# Altium schematic sheet MCU Power.SchDoc
size A; SheetNumber: 3; SheetTotal: 8
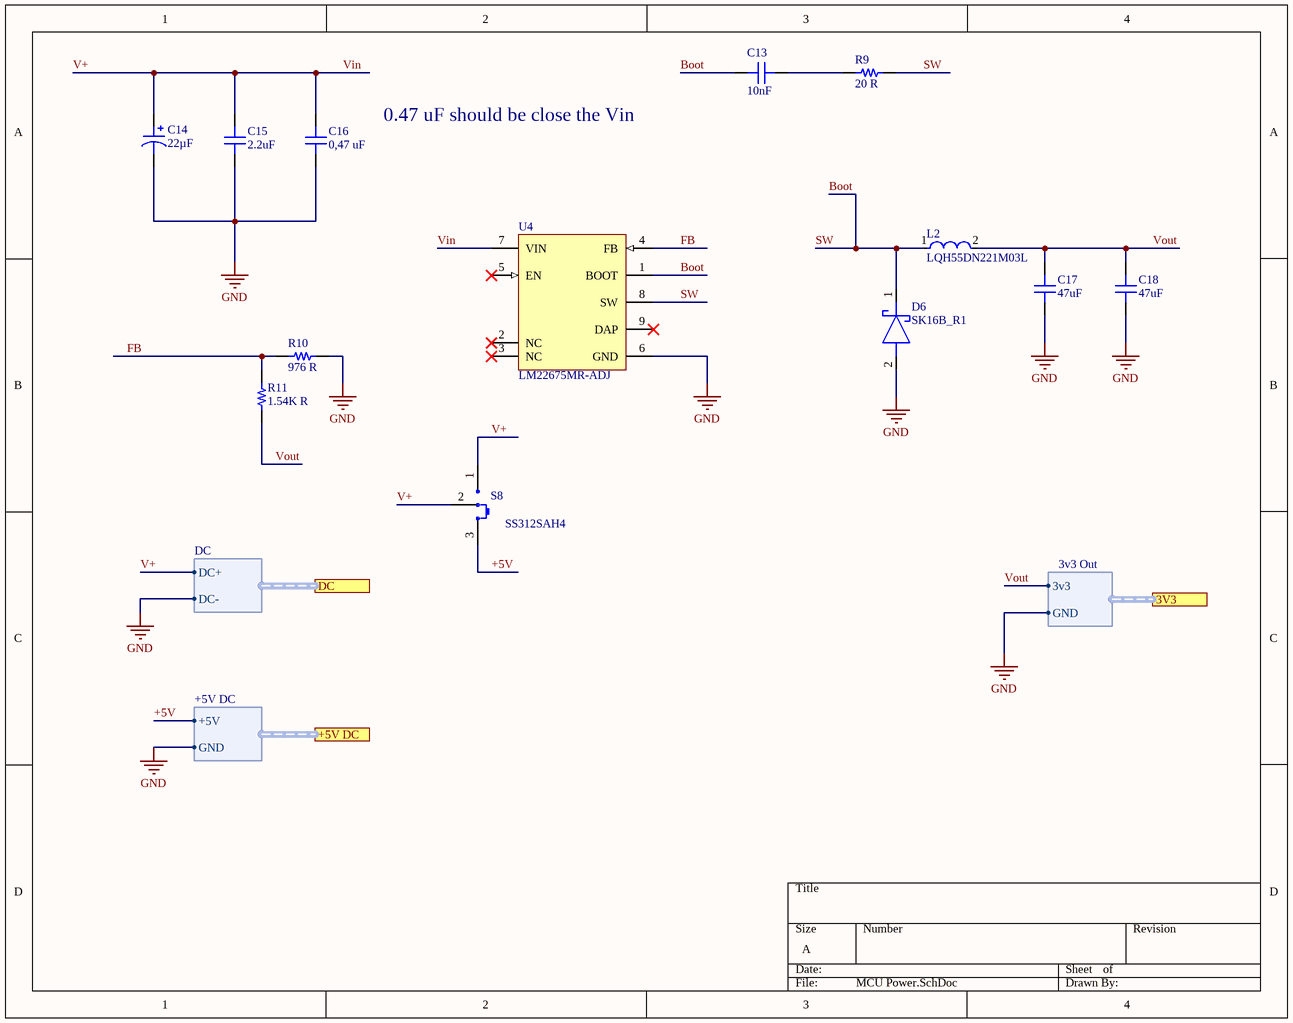
[diagram p0: MCU Power.SchDoc]

## Parts
C13  10nF  [CAP 0603_1608]
C14  22µF  [CAP TH ALUM ELEC D12.50mm S5.00mm H27.00mm]
C15  2.2uF  [CAP 0805_2012]
C16  0,47 uF  [CAP 0603_1608]
C17  47uF  [CAP 0805_2012]
C18  47uF  [CAP 0805_2012]
D6  SK16B_R1  [DIONM5236X261N]
L2  LQH55DN221M03L  [FP-LQH55DN_03-MFG(100uH)]
R9  20 R  [RES 0603_1608]
R10  976 R  [RES 0603_1608]
R11  1.54K R  [RES 0603_1608]
S8  SS312SAH4  [NKK SS312SAH4]
U4  LM22675MR-ADJ  [MRA08B_M]

## Ports
3V3 (harness 3v3 Out), +5V DC (harness +5V DC), DC (harness DC)

## Harnesses
3v3 Out: 3v3, GND
DC: DC+, DC-
+5V DC: +5V, GND

## Nets
GND: C14.2 C15.1 C16.1 C17.1 C18.1 D6.2(A) R10.1 U4.6(GND) ; port 3V3.GND, port DC.DC-, port +5V DC.GND
+5V: S8.3 ; port +5V DC.+5V
Boot: C13.2 D6.1(K) L2.1 R9.1 U4.1(BOOT) U4.8(SW)  [also labelled SW]
FB: R10.2 R11.2 U4.4(FB)
V+: C14.1 C15.2 C16.2 S8.1 S8.2(COM) U4.7(VIN) ; port DC.DC+  [also labelled Vin]
Vout: C17.2 C18.2 L2.2 R11.1 ; port 3V3.3v3
NetC13_1: C13.1 R9.2

Not connected (* = marked no-connect by the designer): U4 2(NC)* 3(NC)* 5(EN)* 9(DAP)*

## Notes on the sheet
- 0.47 uF should be close the Vin

## Library data of the parts
C13 C16 = C0603X101F5GACAUTO: CAP CER 100PF 50V C0G/NP0 0603; Manufacturer: KEMET; Temperature Coefficient: C0G, NP0; Tolerance: ±1%; Part Number: C0603X101F5GACAUTO; Applications: Automotive, Boardflex Sensitive; Capacitance: 100pF; ComponentLink1Description: Datasheet; ComponentLink1URL: https://api.kemet.com/component-edge/download/datasheet/C0603X101F5GACAUTO.pdf; ComponentLink2Description: DigiKey Link; ComponentLink2URL: http://digikey.com/product-detail/en/kemet/C0603X101F5GACAUTO/399-20434-1-ND/9925038; Device Package: 0603 (1608 Metric); Features: Low ESL, Soft Termination; LastUpdated: 2.09.2020 01:03:36; Lifecycle Status: Active; Minimum Order: 1; Mounting Type: Surface Mount, MLCC; Operating Temperature: -55°C ~ 125°C; Package / Case: 0603 (1608 Metric); Packaging: TapeAndReel; PartId: 2136; Part Status: Active; Price: 0.44; Ratings: AEC-Q200; Series: SMD Auto C0G Flex; Size / Dimension: 0.063" L x 0.031" W (1.60mm x 0.80mm); Supplier 1: DigiKey; Supplier Part Number 1: 399-20434-1-ND; Thickness (Max): 0.037" (0.95mm); Voltage - Rated: 50V
  C13: Value: 10nF
  C16: Value: 0,47 uF
C14 = UVZ2V220MHD: CAP ALUM 22UF 20% 350V RADIAL; Manufacturer: Nichicon; Lifetime @ Temp.: 1000 Hrs @ 105°C; Polarization: Polar; Ripple Current @ High Frequency: 184mA @ 10kHz; Ripple Current @ Low Frequency: 115mA @ 120Hz; Part Number: UVZ2V220MHD; Applications: General Purpose; Capacitance: 22µF; ComponentLink1Description: Datasheet; ComponentLink1URL: http://nichicon-us.com/english/products/pdfs/e-uvz.pdf; ComponentLink2Description: DigiKey Link; ComponentLink2URL: http://digikey.com/product-detail/en/nichicon/UVZ2V220MHD/493-1439-ND/589180; Device Package: Radial, Can; Height - Seated (Max): 1.063" (27.00mm); LastUpdated: 2.09.2020 01:32:15; Lead Spacing: 0.197" (5.00mm); Lifecycle Status: Active; Minimum Order: 1; Mounting Type: Through Hole; Operating Temperature: -40°C ~ 105°C; Package / Case: Radial, Can; Packaging: Bulk; PartId: 15243; Part Status: Active; Price: 0.84; Series: UVZ; Size / Dimension: 0.492" Dia (12.50mm); Supplier 1: DigiKey; Supplier Part Number 1: 493-1439-ND; Tolerance: ±20%; Value: 22µF; Voltage - Rated: 350V
C15 C17 C18 = CBR08C330JAGAC: CAP CER 33PF 250V C0G/NP0 0805; Manufacturer: KEMET; Temperature Coefficient: C0G, NP0; Tolerance: ±5%; Part Number: CBR08C330JAGAC; Applications: RF, Microwave, High Frequency; Capacitance: 33pF; ComponentLink1Description: Datasheet; ComponentLink1URL: https://api.kemet.com/component-edge/download/datasheet/CBR08C330JAGAC.pdf; ComponentLink2Description: DigiKey Link; ComponentLink2URL: http://digikey.com/product-detail/en/kemet/CBR08C330JAGAC/399-6202-1-ND/2732182; Device Package: 0805 (2012 Metric); Features: High Q, Low Loss, Ultra Low ESR; LastUpdated: 2.09.2020 01:04:42; Lifecycle Status: Active; Minimum Order: 1; Mounting Type: Surface Mount, MLCC; Operating Temperature: -55°C ~ 125°C; Package / Case: 0805 (2012 Metric); Packaging: TapeAndReel; PartId: 2409; Part Status: Active; Price: 0.44; Series: CBR-SMD RF C0G; Size / Dimension: 0.079" L x 0.049" W (2.00mm x 1.25mm); Supplier 1: DigiKey; Supplier Part Number 1: 399-6202-1-ND; Thickness (Max): 0.035" (0.88mm); Voltage - Rated: 250V
  C15: Value: 2.2uF
  C17 C18: Value: 47uF
D6 = SK16B_R4: Schottky Diode; Manufacturer_Name: Taiwan Semiconductor; Manufacturer_Part_Number: SK16B R4; Datasheet Link: https://docs-emea.rs-online.com/webdocs/0897/0900766b8089796b.pdf; Height: 2.61mm; Mouser Part Number: 821-SK16BR4; Mouser Price/Stock: https://www.mouser.co.uk/ProductDetail/Taiwan-Semiconductor/SK16B-R4?qs=dv9KMQQLqv3ASqrg51Wpkw%3D%3D
L2 = CMP-06042-002541-1: Wire Wound Ferrite Inductor for Power Lines 220μH ±20% 3.36Ω  0.32A 2220; Shielding: Unshielded; Current Rating: 320mA; Series Resistance: 2.4R; Inductance: 220uH; Self Resonant Frequency: 4MHz; Test Frequency: 100kHz; Weight: 0.016932oz; Case Code (Imperial): 2220; Width: 0.197inch; Radiation Hardening: No; Tolerance: 20%; Military Standard: Not; Case Code (Metric): 5750; Height - Seated (Max): 0.198inch; Depth: 5.3mm; Min Operating Temperature: -40°C; Lead Free: Lead Free; Case/Package: 2220; Length: 5.7mm; Max DC Current: 320mA; Termination: SMD/SMT; Height: 4.7mm; Package Quantity: 350; Packaging: Tape and Reel; Mount: Surface Mount; DC Current: 320mA; REACH SVHC: No SVHC; Resistor Type: Wirewound; Max Operating Temperature: 80°C; DC Resistance (DCR): 2.4R; Inductance Tolerance: 20%; Core Material: Ferrite
R9 = RNCS0603BKE10K0: 10-50 ohm; Manufacturer: Stackpole Electronics Inc; Power (Watts): 0.063W, 1/16W; Resistance: 10 kOhms; Temperature Coefficient: ±25ppm/°C; Tolerance: ±0.1%; Part Number: RNCS0603BKE10K0; Value: 20 R; ComponentLink1Description: Datasheet; ComponentLink1URL: https://www.seielect.com/catalog/sei-rncs_rnch.pdf; ComponentLink2Description: DigiKey Link; ComponentLink2URL: http://digikey.com/product-detail/en/stackpole-electronics-inc/RNCS0603BKE10K0/RNCS0603BKE10K0CT-ND/1800113; Composition: Thin Film; Device Package: 0603 (1608 Metric); Features: Anti-Corrosive, Automotive AEC-Q200, Moisture Resistant; Height - Seated (Max): 0.022" (0.55mm); LastUpdated: 2.09.2020 01:10:25; Lifecycle Status: Active; Minimum Order: 1; Number of Terminations: 2; Operating Temperature: -55°C ~ 155°C; Package / Case: 0603 (1608 Metric); Packaging: TapeAndReel; PartId: 4838; Part Status: Active; Price: 0.08; Ratings: AEC-Q200; Series: RNCS; Size / Dimension: 0.061" L x 0.031" W (1.55mm x 0.80mm); Supplier 1: DigiKey; Supplier Part Number 1: RNCS0603BKE10K0CT-ND; Supplier Device Package: 0603
R10 R11 = RNCS0603BKE10K0: RES 10K OHM 0.1% 1/16W 0603; Manufacturer: Stackpole Electronics Inc; Power (Watts): 0.063W, 1/16W; Resistance: 10 kOhms; Temperature Coefficient: ±25ppm/°C; Part Number: RNCS0603BKE10K0; ComponentLink1Description: Datasheet; ComponentLink1URL: https://www.seielect.com/catalog/sei-rncs_rnch.pdf; ComponentLink2Description: DigiKey Link; ComponentLink2URL: http://digikey.com/product-detail/en/stackpole-electronics-inc/RNCS0603BKE10K0/RNCS0603BKE10K0CT-ND/1800113; Composition: Thin Film; Device Package: 0603 (1608 Metric); Features: Anti-Corrosive, Automotive AEC-Q200, Moisture Resistant; Height - Seated (Max): 0.022" (0.55mm); LastUpdated: 2.09.2020 01:10:25; Lifecycle Status: Active; Minimum Order: 1; Number of Terminations: 2; Operating Temperature: -55°C ~ 155°C; Package / Case: 0603 (1608 Metric); Packaging: TapeAndReel; PartId: 4838; Part Status: Active; Price: 0.08; Ratings: AEC-Q200; Series: RNCS; Size / Dimension: 0.061" L x 0.031" W (1.55mm x 0.80mm); Supplier 1: DigiKey; Supplier Part Number 1: RNCS0603BKE10K0CT-ND; Supplier Device Package: 0603; Tolerance: ±0.1%
  R10: Value: 976 R
  R11: Value: 1.54K R
S8 = SS312SAH4: SWITCH SLIDE SPDT 0.4VA 28V; Manufacturer: NKK Switches; Actuator Length: 2.00mm; Actuator Type: Standard; Contact Timing: Shorting (MBB); Current Rating (Amps): 0.4VA (AC/DC); Switch Function: On-On; Part Number: SS312SAH4; Circuit: SPDT; ComponentLink1Description: Datasheet; ComponentLink1URL: http://www.nkkswitches.com/pdf/SS3surfaceMount-1.pdf; ComponentLink2Description: DigiKey Link; ComponentLink2URL: http://digikey.com/product-detail/en/nkk-switches/SS312SAH4/360-3250-ND/1052031; Contact Finish: Gold; Contact Material: Phosphor Bronze; LastUpdated: 4.01.2020 19:15:23; Lifecycle Status: Active; Minimum Order: 1; Mounting Type: Surface Mount, Right Angle; Operating Temperature: -25°C ~ 85°C; Packaging: Tray; PartId: 2; Part Status: Active; Price: 3.02; Series: SS3; Supplier 1: DigiKey; Supplier Part Number 1: 360-3250-ND; Termination Style: Gull Wing; Voltage Rating - AC: 28V; Voltage Rating - DC: 28V
U4 = CMP-0069-00752-2: 1A SIMPLE SWITCHER® Step-Down Voltage Regulator with Precision Enable, 8-pin PSOP; Manufacturer: National Semiconductor; PackageTopMarking: NSXYTT*L22675*ADJ; PowerWise: N; DatasheetVersion: Dec-2010; PackageVersion: revB, Dec-2007; ComponentLink2Description: LM22675 Web Page; ComponentLink3URL: http://www.national.com/packaging/folders/mra08b.html; PackageDescription: Molded, PSOP .193 x .154 x .058in, 8 Lead, .050in Pitch, Large DAP; PinCount: 8; ComponentLink3Description: MRA08B Package Page; Code_JEDEC: MS-012-AA; RevisionNote: DatasheetVersion Updated. Component URLs added; ComponentLink1URL: http://www.national.com/ds/LM/LM22675.pdf; ComponentLink1Description: LM22675 Datasheet; PackageReference: MRA08B; CompType: Switcher; ComponentLink2URL: http://www.national.com/pf/LM/LM22675.html; RoHS: Y